# Altium schematic sheet Cell.SchDoc
size 152 x 101 mm
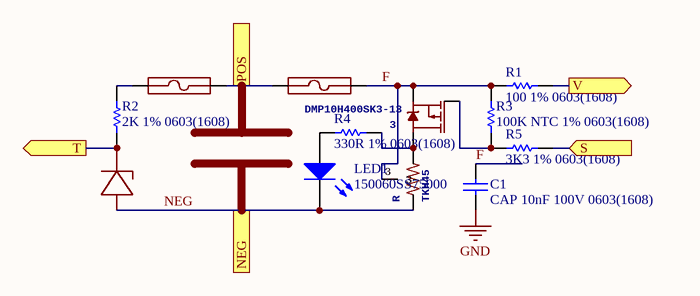
[diagram p0: Cell.SchDoc]

## Parts
3  DMP10H400SK3-13  [TO252]
C1  CAP 10nF 100V 0603(1608)  [CAPC0603(1608)100_N]
CELL+  LI6PT  [6PT]  (value not drawn)  (parts A,B of 2)
F1  0679L  [2410SMD]  (value not drawn)
F2  0679L  [2410SMD]  (value not drawn)
LED1  150060SS75000  [0603_A]
R  TKH45  [TO252-TKH-45]
R1  100 1% 0603(1608)  [RESC0603(1608)_L]
R2  2K 1% 0603(1608)  [RESC0603(1608)_L]
R3  100K NTC 1% 0603(1608)  [RESC0603(1608)_L]
R4  330R 1% 0603(1608)  [RESC0603(1608)_L]
R5  3K3 1% 0603(1608)  [RESC0603(1608)_L]

## Ports
NEG (in), POS (out), S (in), T (out), V (out)

## Nets
GND: C1.1
F: 3.3(S) C1.2 F2.P$2 R.3 R1.2 R3.2
NEG: CELL+.2(TEMP-) CELL+.CELL- LED1.1(K) R.1 ; port NEG
POS: CELL+.CELL+ F1.P$2 F2.P$1 ; port POS
S: R5.1 ; port S
T: CELL+.1(TEMP+) R2.1 ; port T
V: R1.1 ; port V
Net3_1: 3.1(G) R3.1 R5.2
Net3_2: 3.2(D) R.2 R4.1
NetF1_P$1: F1.P$1 R2.2
NetLED1_2: LED1.2(A) R4.2

## Library data of the parts
3 = DMP10H400SK3-13: GateName_1: G$1; SymbolName_1: LABELED-PMOS; LibraryName: IFE_Transistors; DeviceSetName: DMP10H400SK3-13; Package: TO252
C1 = CMP-1035-02324-1: CAP 10nF 100V ±5% 0603 (1608 Metric) Thickness 1mm SMD; Case-EIA: 0603; Tolerance: Â±5%; Case-Metric: 1608; Technology: SMT; Value: 10nF; Max Thickness: 1 mm; Rated Voltage: 100 V
CELL+ = LI6PT: GateName_1: G$1; SymbolName_1: ENERGUS_CELL; GateName_2: G$2; SymbolName_2: TEMP_JST_XH; LibraryName: IFE_Energus; DeviceSetName: LI6PT; Package: 6PT
F1 F2 = 0679L: GateName_1: G$1; SymbolName_1: FUSE; LibraryName: IFE_Fuses; DeviceSetName: 0679L; Package: 2410SMD
LED1 = CMP-1426-00004-1: SMD mono-color Chip LED, WL-SMCW, Super Red; Manufacturer: Wuerth Elektronik; PartNumber: 150060SS75000; ComponentLink2URL: http://katalog.we-online.com/led/datasheet/150060SS75000.pdf; ComponentLink2Description: Datasheet; PackageReference: 0603_A; ComponentLink1Description: Manufacturer URL; ComponentLink1URL: http://www.we-online.com; Color: Super Red
R = TKH45: GateName_1: G$1; SymbolName_1: R-US; LibraryName: IFE_Resistors; DeviceSetName: TKH45; Package: TO252-TKH-45
R1 = CMP-1012-00222-1: 100R 0.1W 1% 0603 (1608 Metric)  SMD; Case-Metric: 1608; Case-EIA: 0603; Value: 2.94 Ohm; Power: 0.1 W; Technology: SMT; Tolerance: 1 %
R2-R5 = CMP-1012-00222-1: 2R94 0.1W 1% 0603 (1608 Metric)  SMD; Case-Metric: 1608; Case-EIA: 0603; Value: 2.94 Ohm; Power: 0.1 W; Technology: SMT; Tolerance: 1 %